# Altium schematic sheet espButton.schdoc
size 168 x 131 mm
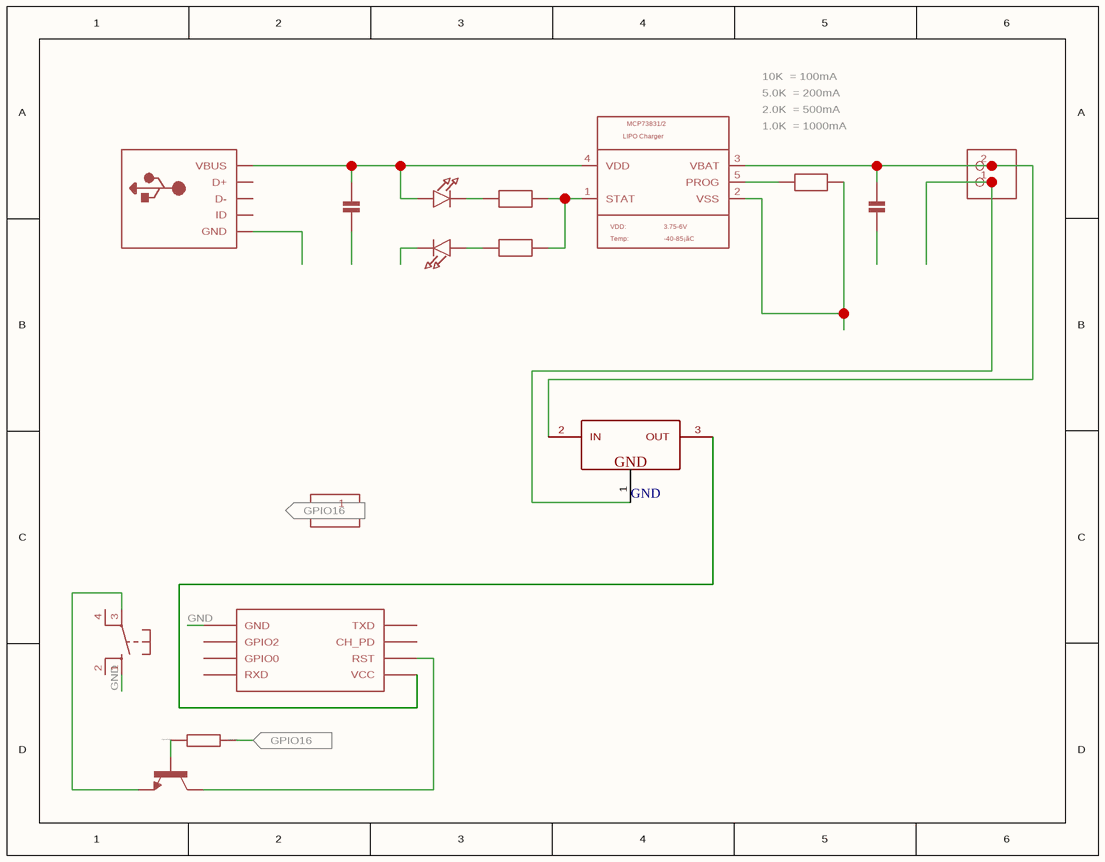
[diagram p0: espButton.schdoc]

## Parts
(Parts that share a designator on the sheet are numbered #1, #2 ... from top to bottom, then left to right.)
?#1  (no value)  [JSTPH2]
?#2  (no value)  [SOT23-5]
?#3  (no value)  [0805-NO]
?#4  (no value)  [4UCONN_20329]
?#5  (no value)  [CHIPLED_0805_NOOUTLINE]
?#6  (no value)  [0805-NO]
?#7  (no value)  [0805-NO]
?#8  (no value)  [0805-NO]
?#9  (no value)  [CHIPLED_0805_NOOUTLINE]
?#10  (no value)  [0805-NO]
?#11  (no value)  [TO92]
?#12  (no value)  [1X01-CLEANBIG]
?#13  (no value)  [B3F-10XX]
?#14  (no value)  [ESP01]
?#15  (no value)  [0204/7]
?#16  (no value)  [TO92-EBC]

## Ports
GPIO16

## Nets
GND: ?#1.1 ?#11.1(GND) ?#13.1(S) ?#14.GND
GPIO16: ?#12.1 ?#15.2 ; port GPIO16
Net?#1_2: ?#1.2 ?#2.3(VBAT) ?#8.1 ?#11.2(IN)
Net?#2_1: ?#2.1(STAT) ?#6.2 ?#10.2
Net?#2_2: ?#2.2(VSS) ?#3.2
Net?#2_4: ?#2.4(VDD) ?#4.VBUS ?#5.A ?#7.1
Net?#2_5: ?#2.5(PROG) ?#3.1
Net?#4_BASE@1: ?#4.BASE@1(GND) ?#4.BASE@2(GND) ?#4.GND ?#4.SPRT@1(GND) ?#4.SPRT@2(GND) ?#4.SPRT@3(GND) ?#4.SPRT@4(GND)
Net?#5_C: ?#5.C ?#6.1
Net?#9_A: ?#9.A ?#10.1
Net?#11_3: ?#11.3(OUT) ?#14.VCC
Net?#13_3: ?#13.3(P) ?#16.E
Net?#14_RST: ?#14.RST ?#16.C
Net?#15_1: ?#15.1 ?#16.B

Not connected (* = marked no-connect by the designer): ?#4 D+ D- ID; ?#7 2; ?#8 2; ?#9 C; ?#13 2(S1) 4(P1); ?#14 CH_PD GPIO0 GPIO2 RX(RXD) TX(TXD)

## Notes on the sheet
- 10K  = 100mA
- 5.0K  = 200mA
- 2.0K  = 500mA
- 1.0K  = 1000mA
- (in symbol ?) SpiceOrder 1; SpiceOrder 2; MCP73831/2; LIPO Charger; VDD:; 3.75-6V; Temp:; -40-85¡ãC

## Library data of the parts
?#11 = (no symbol name): catid: 20; description: Low Power Consumption LDO, Output Voltage 3.3V, TO92 Pkg; BOM_Manufacturer Part: ?; spicePre: U